# EAGLE design pcb-bldc-servo-3 (EAGLE 9.6.2)
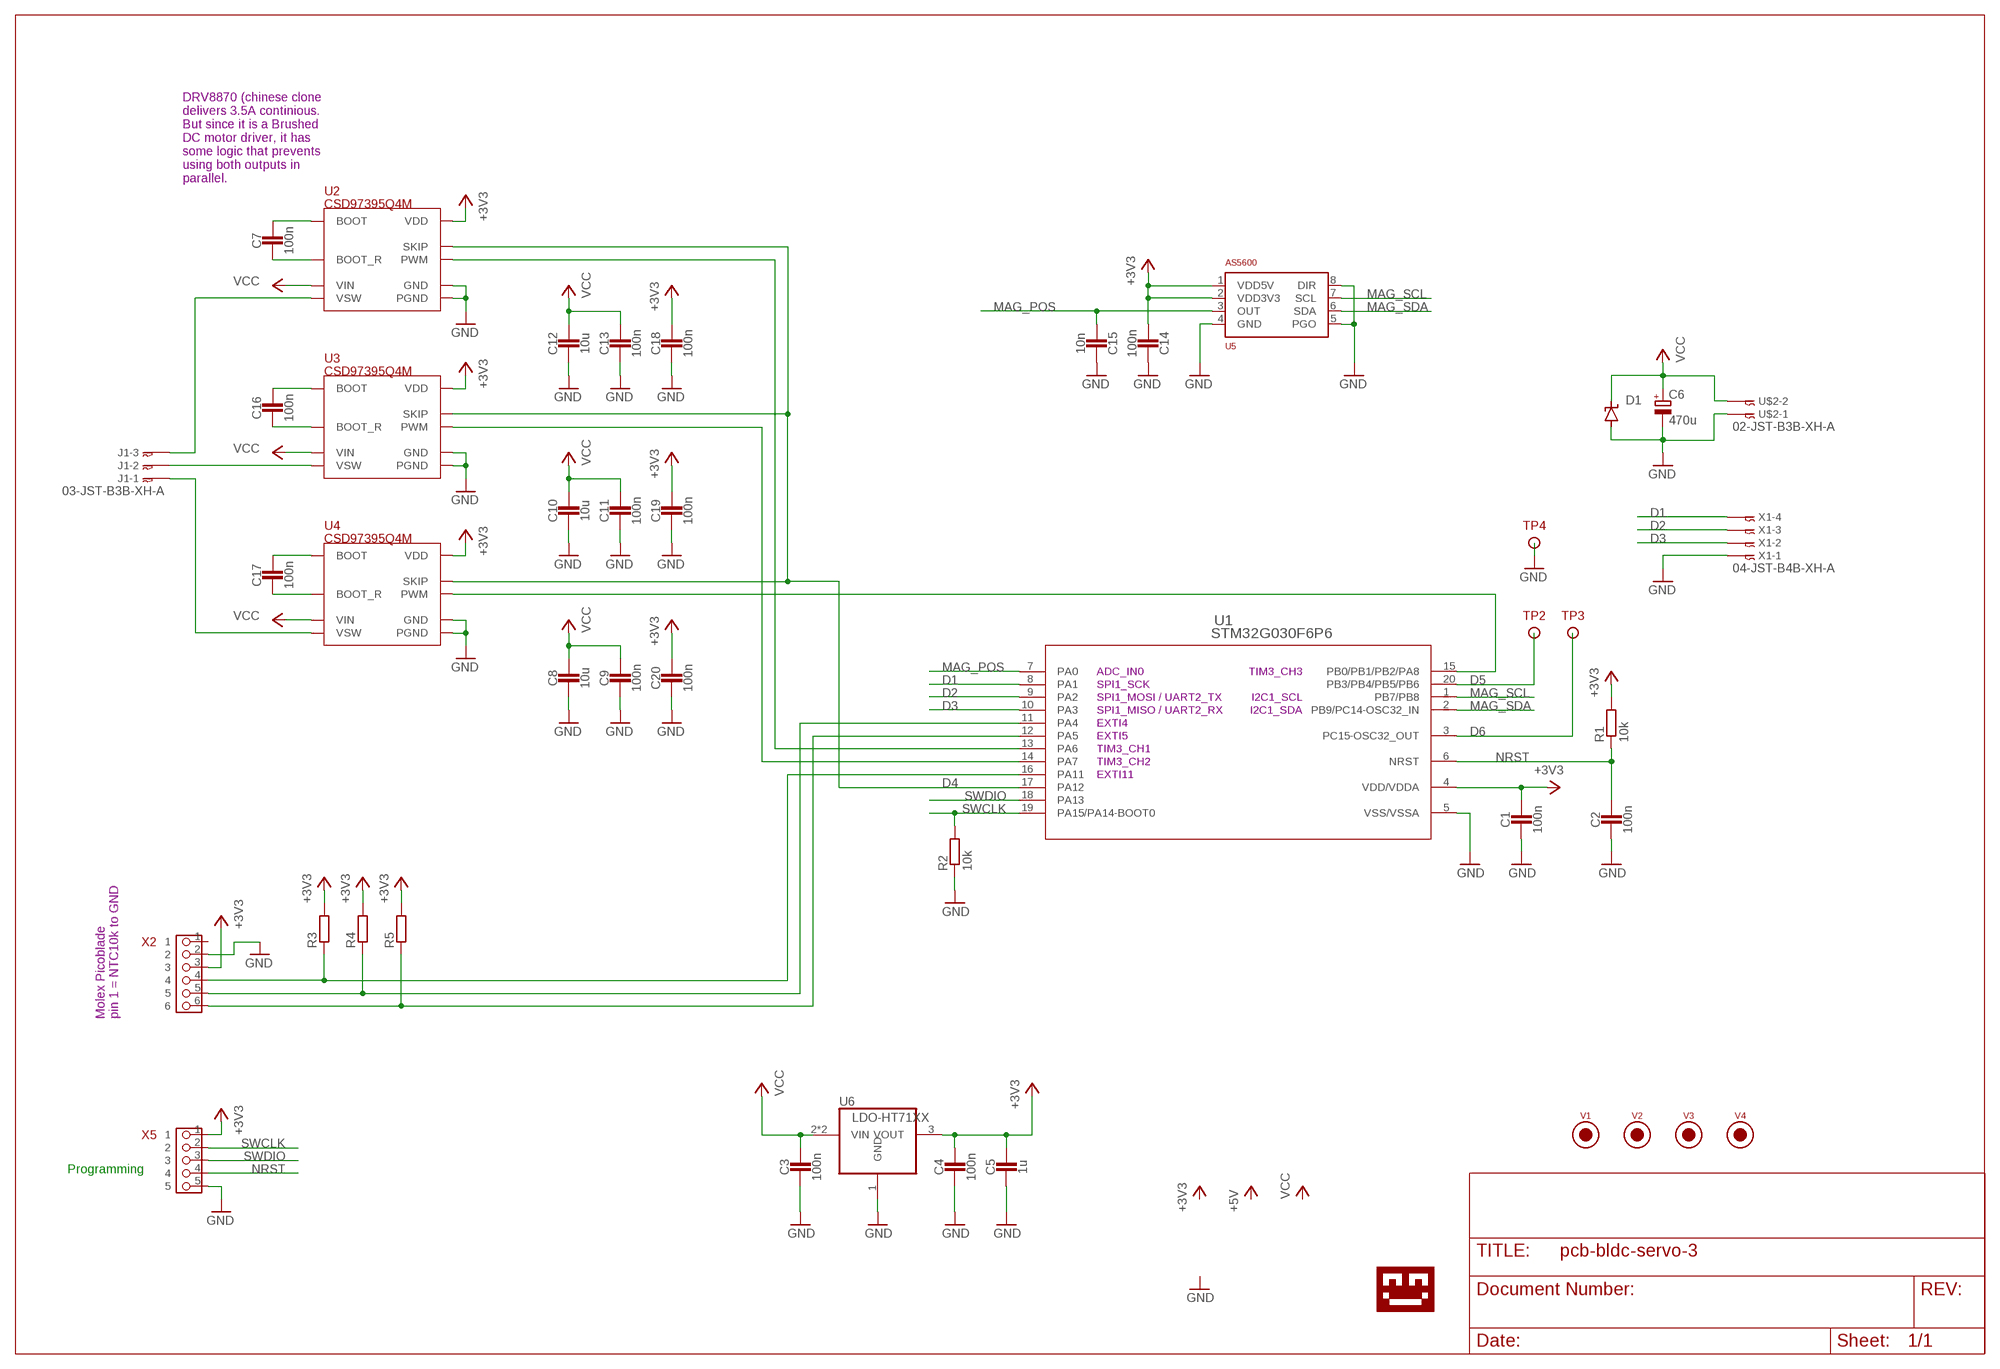
[diagram p0: schematic, sheet 1]

## Parts
C1  100n  CAPACITOR0603_CAP  [0603_CAP]
C2  100n  CAPACITOR0603_CAP  [0603_CAP]
C3  100n  CAPACITOR0603_CAP  [0603_CAP]
C4  100n  CAPACITOR0603_CAP  [0603_CAP]
C5  1u  CAPACITOR0603_CAP  [0603_CAP]
C6  470u  CPOL-EU153CLV-1010  [153CLV-1010]
C7  100n  CAPACITOR0603_CAP  [0603_CAP]
C8  10u  CAPACITOR1206_CAP  [1206_CAP]
C9  100n  CAPACITOR0603_CAP  [0603_CAP]
C10  10u  CAPACITOR1206_CAP  [1206_CAP]
C11  100n  CAPACITOR0603_CAP  [0603_CAP]
C12  10u  CAPACITOR1206_CAP  [1206_CAP]
C13  100n  CAPACITOR0603_CAP  [0603_CAP]
C14  100n  CAPACITOR0603_CAP  [0603_CAP]
C15  10n  CAPACITOR0603_CAP  [0603_CAP]
C16  100n  CAPACITOR0603_CAP  [0603_CAP]
C17  100n  CAPACITOR0603_CAP  [0603_CAP]
C18  100n  CAPACITOR0603_CAP  [0603_CAP]
C19  100n  CAPACITOR0603_CAP  [0603_CAP]
C20  100n  CAPACITOR0603_CAP  [0603_CAP]
D1  SUPPRESSOR-SMBJ  [SMBJ]
J1  03-JST-B3B-XH-A  [B3B-XH]
R1  10k  RESISTOR0603_RES  [0603-RES]
R2  10k  RESISTOR0603_RES  [0603-RES]
R3  RESISTOR0603_RES  [0603-RES]
R4  RESISTOR0603_RES  [0603-RES]
R5  RESISTOR0603_RES  [0603-RES]
TP2  TESTPIN1MM  [PIN-SMD-1X1-TEST_1M0]
TP3  TESTPIN1MM  [PIN-SMD-1X1-TEST_1M0]
TP4  TESTPIN1MM  [PIN-SMD-1X1-TEST_1M0]
U1  STM32G030F6P6  [TSSOP20]
U2  CSD97395Q4M  [CSD97395Q4M]
U3  CSD97395Q4M  [CSD97395Q4M]
U4  CSD97395Q4M  [CSD97395Q4M]
U5  AS5600  [SOIC-8]
U6  LDO-HT71XX  [SOT-89]
U$1  LOGO-TOBENG-1MM-FINISH  [TOBENG-1MM-FINISH]
U$2  02-JST-B3B-XH-A  [B2B-XH]
V1  FIDUCIAL2MM  [FIDUCIAL_2MM]
V2  FIDUCIAL2MM  [FIDUCIAL_2MM]
V3  FIDUCIAL2MM  [FIDUCIAL_2MM]
V4  FIDUCIAL2MM  [FIDUCIAL_2MM]
X1  04-JST-B4B-XH-A  [B4B-XH]
X2  PIN_6X1  [PIN_6X1_MOLEX_PICOBLADE]
X5  PIN_5X1HD  [PIN_5X1_HD]

## Nets
+3V3: C1.1 C4.1 C5.1 C14.1 C18.1 C19.1 C20.1 R1.2 R3.2 R4.2 R5.2 U1.4(VDD/VDDA) U2.VDD U2.VDD1(VDD) U3.VDD U3.VDD1(VDD) U4.VDD U4.VDD1(VDD) U5.1(VDD5V) U5.2(VDD3V3) U6.3(VOUT) X2.3 X5.1
D1: U1.8(PA1) X1.P$4
D2: U1.9(PA2) X1.P$3
D3: U1.10(PA3) X1.P$2
D4: U1.17(PA12) U2.SKIP U2.SKIP1(SKIP) U3.SKIP U3.SKIP1(SKIP) U4.SKIP U4.SKIP1(SKIP)
D5: TP2.1 U1.20(PB3/PB4/PB5/PB6)
D6: TP3.1 U1.3(PC15-OSC32_OUT)
GND: C1.2 C2.2 C3.2 C4.2 C5.2 C6.- C8.2 C9.2 C10.2 C11.2 C12.2 C13.2 C14.2 C15.2 C18.2 C19.2 C20.2 D1.A R2.1 TP4.1 U1.5(VSS/VSSA) U2.GND U2.GND1(GND) U2.PGND U3.GND U3.GND1(GND) U3.PGND U4.GND U4.GND1(GND) U4.PGND U5.4(GND) U5.5(PGO) U5.8(DIR) U6.1(GND) U$2.P$1 X1.P$1 X2.2 X5.5
MAG_POS: C15.1 U1.7(PA0) U5.3(OUT)
MAG_SCL: U1.1(PB7/PB8) U5.7(SCL)
MAG_SDA: U1.2(PB9/PC14-OSC32_IN) U5.6(SDA)
N$1: C7.1 U2.BOOT U2.BOOT1(BOOT)
N$2: C7.2 U2.BOOT_R U2.BOOT_R1(BOOT_R)
N$3: J1.P$2 U3.VSW U3.VSW1(VSW) U3.VSW2(VSW) U3.VSW3(VSW) U3.VSW4(VSW) U3.VSW5(VSW) U3.VSW6(VSW)
N$4: J1.P$3 U2.VSW U2.VSW1(VSW) U2.VSW2(VSW) U2.VSW3(VSW) U2.VSW4(VSW) U2.VSW5(VSW) U2.VSW6(VSW)
N$5: U1.13(PA6) U2.PWM U2.PWM1(PWM)
N$6: U1.14(PA7) U3.PWM U3.PWM1(PWM)
N$7: J1.P$1 U4.VSW U4.VSW1(VSW) U4.VSW2(VSW) U4.VSW3(VSW) U4.VSW4(VSW) U4.VSW5(VSW) U4.VSW6(VSW)
N$8: C16.1 U3.BOOT U3.BOOT1(BOOT)
N$9: U1.15(PB0/PB1/PB2/PA8) U4.PWM U4.PWM1(PWM)
N$10: C16.2 U3.BOOT_R U3.BOOT_R1(BOOT_R)
N$11: C17.1 U4.BOOT U4.BOOT1(BOOT)
N$12: C17.2 U4.BOOT_R U4.BOOT_R1(BOOT_R)
N$24: R5.1 U1.12(PA5) X2.6
N$25: R4.1 U1.11(PA4) X2.5
N$28: R3.1 U1.16(PA11) X2.4
NRST: C2.1 R1.1 U1.6(NRST) X5.4
SWCLK: R2.2 U1.19(PA15/PA14-BOOT0) X5.2
SWDIO: U1.18(PA13) X5.3
VCC: C3.1 C6.+ C8.1 C9.1 C10.1 C11.1 C12.1 C13.1 D1.C U2.VIN U2.VIN1(VIN) U2.VIN2(VIN) U2.VIN3(VIN) U2.VIN4(VIN) U2.VIN5(VIN) U2.VIN6(VIN) U3.VIN U3.VIN1(VIN) U3.VIN2(VIN) U3.VIN3(VIN) U3.VIN4(VIN) U3.VIN5(VIN) U3.VIN6(VIN) U4.VIN U4.VIN1(VIN) U4.VIN2(VIN) U4.VIN3(VIN) U4.VIN4(VIN) U4.VIN5(VIN) U4.VIN6(VIN) U6.2(VIN) U6.2@1(VIN) U$2.P$2
Unconnected: X2.1

## Notes on the sheet
- DRV8870 (chinese clone
  delivers 3.5A continious.
  But since it is a Brushed
  DC motor driver, it has
  some logic that prevents
  using both outputs in 
  parallel.
- ADC_IN0 | TIM3_CH3
- SPI1_SCK
- SPI1_MOSI / UART2_TX | I2C1_SCL
- SPI1_MISO / UART2_RX | I2C1_SDA
- EXTI4
- EXTI5
- TIM3_CH1
- TIM3_CH2
- EXTI11
- Molex Picoblade
  pin 1 = NTC10k to GND
- Programming

## Library data of the parts
C1-C5 C7-C20 = passives:CAPACITOR: SMD Capacitor
C6 = resistor:CPOL-EU: POLARIZED CAPACITOR, European symbol
D1 = diode:SUPPRESSOR-: Suppressor diode
J1 = bt_con-jst-xh:03-JST: JST CONNECTOR
R1-R5 = passives:RESISTOR: Resistor Basic schematic elements and footprints for 0201, 0402, 0603, 1206, and PTH resistors.
TP2-TP4 = ftobler_backup:TESTPIN
U1 = stm32:STM32G030F6P6; COPYRIGHT: Copyright (C) 2024 Ultra Librarian. All rights reserved.; MANUFACTURER_PART_NUMBER: STM32G030F6P6; MFR_NAME: STMicroelectronics
U2-U4 = ftobler:CSD97395Q4M
U5 = ftobler:AS5600
U6 = ftobler:LDO
U$1 = ftobler:LOGO
U$2 = bt_con-jst-xh:02-JST: JST CONNECTOR
V1-V4 = ftobler - Copy:FIDUCIAL
X1 = bt_con-jst-xh:04-JST: JST CONNECTOR
X2 = ftobler-conn:PIN_6X1
X5 = ftobler-conn:PIN_5X1

## Board
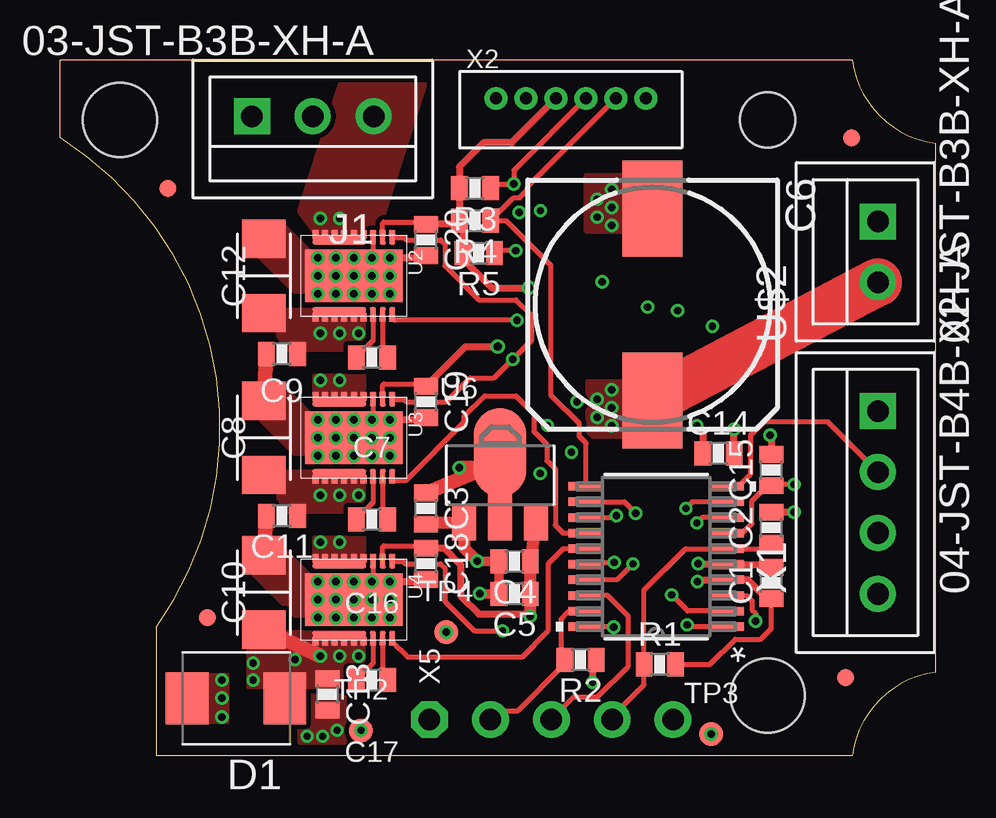
[diagram p1: board, top side]
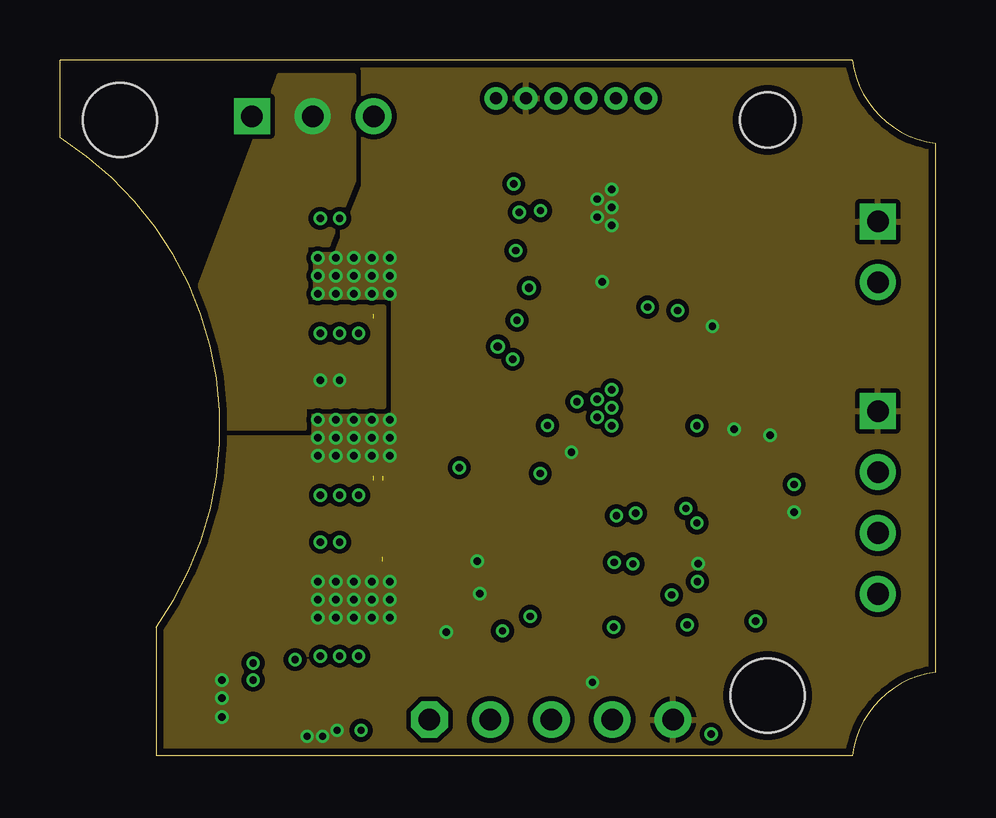
[diagram p2: board, inner layer Route2]
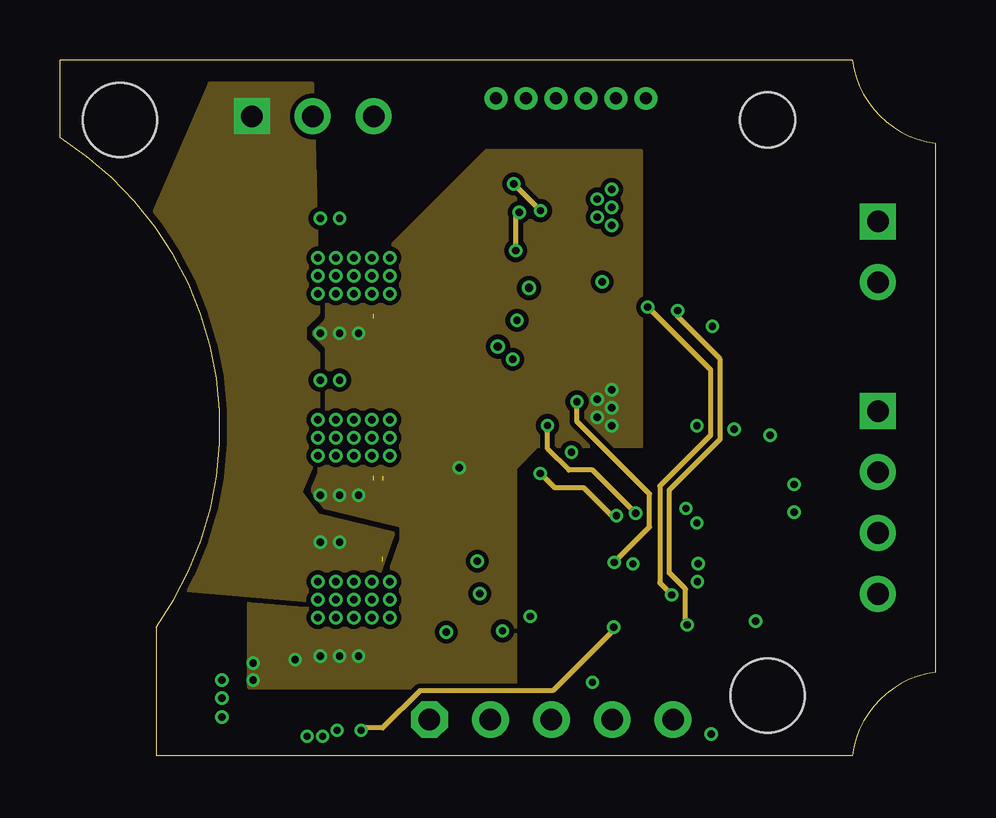
[diagram p3: board, inner layer Route15]
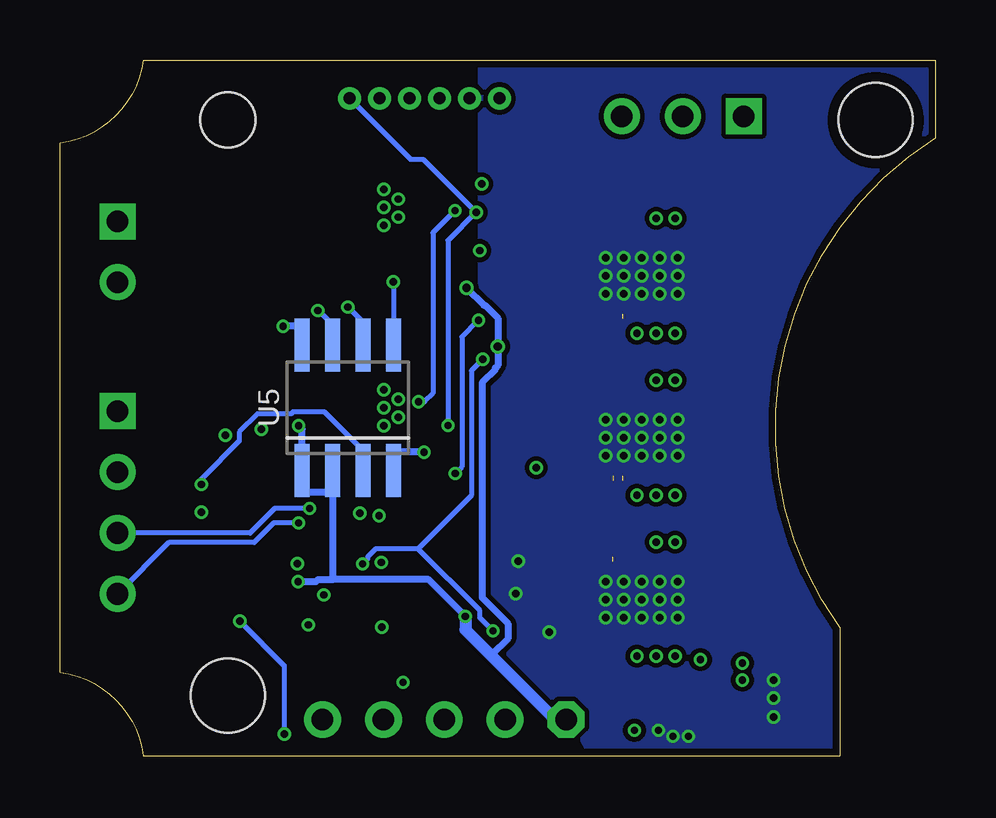
[diagram p4: board, bottom side, seen from below]

Size 36.5 x 29 mm. Coordinates in mm from the lower left corner, seen from the top.
Outline: 36.5,3.47 arc76 33.03,0 4,0 4,5.34 arc93 0,25.76 0,29 33.03,29 arc76 36.5,25.53 36.5,3.47
Copper layers (1+2*15+16): Top 0.035mm / dielectric 0.2mm / Route2 0.035mm / dielectric 0.4mm / Route15 0.035mm / dielectric 0.2mm / Bottom 0.035mm
Design rules "default *": minimum track width 0.15mm, minimum drill 0.2mm, track to track 0.2mm, track to pad 0.2mm, pad to pad 0.15mm, via to via 0.2mm, smd to smd 0.2mm, copper to edge 0.3mm, drill to drill 10mil, minimum pad ring 0.125mm, minimum via ring 0.125mm, stop-mask expansion 0.05mm, vias tented up to drill 0.35mm, thermal gap 0.2mm
Holes 3.1 mm at 2.5,26.5 29.5,2.5
Holes 2.3 mm at 29.5,26.5
tRestrict: area 0.5,24.5 to 4.5,28.5; area 27.5,24.5 to 31.5,28.5; area 27.5,0.5 to 31.5,4.5
bRestrict: area 0.5,24.5 to 4.5,28.5; area 27.5,24.5 to 31.5,28.5; area 27.5,0.5 to 31.5,4.5; 1 lines

### Footprints (pad centres in the part's own frame; a part is rotated, then mirrored left to right if it is on the bottom)
0603_CAP = smd 0.7 x 1: 1 -0.65,0; 2 0.65,0
153CLV-1010 = smd 4 x 2.5: + 4,0; - -4,0
1206_CAP = smd 1.6 x 1.8: 1 -1.55,0; 2 1.55,0
SMBJ = smd 1.78 x 2.16: A 2.04,0; C -2.03,0
B3B-XH = drill 0.9 pad 1.5 square: P$1 2.54,0 | drill 0.9 pad 1.5: P$2 0,0; P$3 -2.54,0
0603-RES = smd 0.7 x 1: 1 -0.65,0; 2 0.65,0
PIN-SMD-1X1-TEST_1M0 = smd 1 x 1: 1 0,0
TSSOP20 = smd 1.462 x 0.355: 1 -2.921,2.925; 2 -2.921,2.275; 3 -2.921,1.625; 4 -2.921,0.975; 5 -2.921,0.325; 6 -2.921,-0.325; 7 -2.921,-0.975; 8 -2.921,-1.625; 9 -2.921,-2.275; 10 -2.921,-2.925; 11 2.921,-2.925; 12 2.921,-2.275; 13 2.921,-1.625; 14 2.921,-0.975; 15 2.921,-0.325; 16 2.921,0.325; 17 2.921,0.975; 18 2.921,1.625; 19 2.921,2.275; 20 2.921,2.925
CSD97395Q4M = smd 0.25 x 0.6: BOOT -1.2,1.6; BOOT_R -0.8,1.6; GND -0.8,-1.6; PWM -1.6,1.6; SKIP -1.6,-1.6; VDD -1.2,-1.6 | smd 0.25 x 0.25: BOOT1 -1.2,1.775; BOOT_R1 -0.8,1.775; GND1 -0.8,-1.775; PWM1 -1.6,1.775; SKIP1 -1.6,-1.775; VDD1 -1.2,-1.775 | smd 4.05 x 2.2: PGND 0,0 | smd 2.25 x 0.375: VIN 0.6,1.488; VSW 0.6,-1.488 | smd 0.25 x 0.35: VIN1 -0.4,1.725; VIN2 0,1.725; VIN3 0.4,1.725; VIN4 0.8,1.725; VIN5 1.2,1.725; VIN6 1.6,1.725; VSW1 -0.4,-1.725; VSW2 0,-1.725; VSW3 0.4,-1.725; VSW4 0.8,-1.725; VSW5 1.2,-1.725; VSW6 1.6,-1.725
SOIC-8 = smd 0.61 x 2.21: 1 -1.905,-2.616; 2 -0.635,-2.616; 3 0.635,-2.616; 4 1.905,-2.616; 5 1.905,2.616; 6 0.635,2.616; 7 -0.635,2.616; 8 -1.905,2.616
SOT-89 = smd 1 x 1.5: 1 -1.499,-1.981; 3 1.499,-1.981 | smd 1 x 2: 2 0,-1.727 | smd 2.2 x 3.7: 2@1 0,0.94
B2B-XH = drill 0.9 pad 1.5 square: P$1 1.27,0 | drill 0.9 pad 1.5: P$2 -1.27,0
FIDUCIAL_2MM = smd 0.7 x 0.7: V 0,0
B4B-XH = drill 0.9 pad 1.5 square: P$1 3.81,0 | drill 0.9 pad 1.5: P$2 1.27,0; P$3 -1.27,0; P$4 -3.81,0
PIN_6X1_MOLEX_PICOBLADE = drill 0.5 pad 0.95: 1 -3.125,0; 2 -1.875,0; 3 -0.625,0; 4 0.625,0; 5 1.875,0; 6 3.125,0
PIN_5X1_HD = drill 0.9 pad 1.54 octagon: 1 0,0 | drill 0.9 pad 1.54: 2 0,-2.54; 3 0,-5.08; 4 0,-7.62; 5 0,-10.16

### Placement (x,y rotation side)
C1  29.65,7.2 90 top
C2  29.65,9.5 90 top
C3  15.25,10.3 270 top
C4  18.95,8.1 180 top
C5  18.95,6.75 180 top
C6  24.7,18.8 270 top
C7  13,16.6 180 top
C8  8.5,13.25 90 top
C9  9.25,16.75 180 top
C10  8.5,6.8 90 top
C11  9.25,10 180 top
C12  8.5,20 90 top
C13  11.15,2.55 270 top
C14  27.45,12.6 0 top
C15  29.65,11.9 90 top
C16  13,9.85 180 top
C17  13,3.15 180 top
C18  15.25,8 270 top
C19  15.25,14.75 270 top
C20  15.25,21.5 270 top
D1  7.35,2.39 180 top
J1  10.54,26.65 180 top
R1  25,3.8 0 top
R2  21.7,4 180 top
R3  17.3,23.65 180 top
R4  17.3,22.3 180 top
R5  17.45,20.95 180 top
TP2  12.55,1.05 0 top
TP3  27.15,0.9 0 top
TP4  16.1,5.15 0 top
U1  24.85,8.3 180 top
U2  12.25,20 180 top
U3  12.25,13.25 180 top
U4  12.25,6.5 180 top
U5  24.5,14.5 0 bottom
U6  18.35,11.7 0 top
U$1  11.45,14.95 90 bottom
U$2  34.1,21 90 top
V1  4.5,23.65 0 top
V2  33,25.75 0 top
V3  32.75,3.25 0 top
V4  6.15,5.75 0 top
X1  34.1,10.55 90 top
X2  21.3,27.4 0 top
X5  15.4,1.5 90 top

### Tracks (layer width: path | path; a pad name or v marks a point on that pad's centre or on a via)
+3V3  (via drill 0.3 pad 0.45, 0.35)  (1 unrouted)
  Top 0.2: R1.2 27.1,3.8 28.15,4.85 29.2,4.85 29.65,5.3 C1.1 | C18.1 15.15,8.75 13.5,8.75 13.45,8.7 U4.VDD | C19.1 15.15,15.5 13.5,15.5 13.45,15.45 U3.VDD U3.VDD1 | 15.4,22.3 C20.1 15.15,22.25 13.5,22.25 13.45,22.2 U2.VDD1 U2.VDD
  Top 0.3: X2.3 18.82,25.55 17.65,25.55 16.65,24.55 R3.2 R4.2 | R4.2 16.8,22.15 R5.2 16.8,20.7 18,19.5 v19.55,19.5 | C1.1 29.45,6.55 28.68,7.33 U1.4 26.65,7.33 v26.58,7.25 | v26.55,13.75 26.8,13.5 C14.1 | R4.2 16.5,22.15 C20.1 | C18.1 16,8.65 16.7,7.95 16.7,6.67 17.47,5.9 19.5,5.9 v19.6,5.8 | C19.1 16.9,17.05 v18.25,17.05
  Top 0.5: U6.3 C4.1 C5.1 v19.6,5.8
  Bottom 0.3: v26.55,13.75 26.41,13.61 U5.1 26.41,11.01 26.4,11 25.22,11 25.14,11.09 | 25.14,11.09 U5.2 25.14,7.34 | 25.14,11.09 25.05,11 | v26.58,7.25 25.83,7.25 25.76,7.33 25.15,7.33 25.14,7.34 | v19.6,5.8 21.14,7.34 25.14,7.34 | v19.55,19.5 18.82,18.77 18.79,18.77 18.25,18.23 v18.25,17.05 18.25,16.27 18.35,16.17 18.35,16.1 18.9,15.55 18.9,6.58 17.82,5.51 17.82,4.88 18.52,4.17
  Bottom 0.5: v19.6,5.8 19.6,5.25 18.52,4.17 15.85,1.5 X5.1
D1  (via drill 0.3 pad 0.45)
  Top 0.2: U1.8 26.77,9.93 v26.55,9.7
  Bottom 0.2: v26.55,9.7 27.58,9.7 28.4,8.88 31.96,8.88 X1.P$4
D2  (via drill 0.3 pad 0.45)
  Top 0.2: U1.9 26.36,10.57 v26.09,10.3
  Bottom 0.2: v26.09,10.3 27.55,10.3 28.57,9.28 X1.P$3
D3
  Top 0.2: U1.10 28.27,11.22 28.8,11.75 28.8,13.36 29.36,13.93 32,13.93 X1.P$2
D4  (via drill 0.3 pad 0.45)
  Top 0.2: v23.89,7.99 23.22,7.33 U1.17 | v18.45,5.2 17.28,5.2 16.05,6.43 16.05,7.82 15.87,8 14.4,8 14.3,8.1 U4.SKIP U4.SKIP1 | U3.SKIP1 U3.SKIP 14.35,14.85 14.45,14.75 16.1,14.75 17.1,15.75 18.1,15.75 v18.88,16.52 19.65,17.3 19.65,18.36 19.01,19 17.48,19 16.05,20.43 16.05,21.32 15.87,21.5 14.45,21.5 14.35,21.6 U2.SKIP U2.SKIP1
  Bottom 0.2: v18.45,5.2 19,5.75 19,6.05 21.58,8.62 | v23.89,7.99 23.68,8.2 23.68,8.29 23.34,8.62 21.58,8.62 | v18.88,16.52 19.35,16.05 19.35,10.85 21.58,8.62
D5  (via drill 0.3 pad 0.45)
  Top 0.2: U1.20 23.06,5.38 v23.09,5.35
  Route15 0.2: v23.09,5.35 23.09,5.24 20.55,2.7 15,2.7 13.46,1.16 12.55,1.16 TP2.1
  other vias: 12.55,1.05
D6  (via drill 0.3 pad 0.45)
  Top 0.2: U1.3 28.62,6.67 28.85,6.45 28.85,6.08 29,5.93 v29,5.6
  Bottom 0.2: v29,5.6 27.15,3.75 TP3.1
  other vias: 27.15,0.9
GND  (via drill 0.3 pad 0.45)
  Top 0.2: v13,7.25 13.05,7.3 U4.GND U4.GND1 | v13,14 13.05,14.05 U3.GND U3.GND1 | v13,20.75 13.05,20.8 U2.GND U2.GND1
  Top 0.3: R2.1 22.2,3.85 v22.2,3.05 | C14.2 v28.1,13.6 | v29.6,13.35 29.65,13.3 C15.2 | C2.2 v30.6,10.15 | C1.2 29.52,7.97 U1.5 26.62,7.97 v26.6,8 | C20.2 15.15,20.75 v13.75,20.75 | C19.2 15.15,14 v13.75,14 | C18.2 15.15,7.25 v13.75,7.25
  Top 0.4: v17.5,6.75 C5.2 C4.2 v17.4,8.1
  Top 0.5: C3.2 15.25,9.72 U6.1 16.85,8.65 v17.4,8.1
  Top 0.6: C9.2 C8.2 | C11.2 8.58,9.98 C10.2
  Route15 0.2: TP4.1 16.15,5.15
  Bottom 0.2: v22.6,19.75 U5.5
  Bottom 0.3: U5.5 | v27.2,17.9 26.7,17.9 26.41,17.61 U5.8 | v21.32,12.65 22.5,12.65 22.59,12.55 U5.4
  other vias: 11.5,20 11.5,20.75 12.25,20.75 12.25,20 12.25,19.25 13,19.25 13,20 13.75,20 13.75,19.25 23,23.6 23,22.85 23,22.1 22.4,22.45 22.4,23.2 16.1,5.15 11.5,19.25 10.75,19.25 10.75,20 10.75,20.75 11.5,13.25 11.5,14 12.25,14 12.25,13.25 12.25,12.5 13,12.5 13,13.25 13.75,13.25 13.75,12.5 11.5,12.5 10.75,12.5 10.75,13.25 10.75,14 11.5,6.5 11.5,7.25 12.25,7.25 12.25,6.5 12.25,5.75 13,5.75 13,6.5 13.75,6.5 13.75,5.75 11.5,5.75 10.75,5.75 10.75,6.5 10.75,7.25 11.55,1.05 10.3,0.8 10.95,0.8 6.75,3.15 6.75,1.6 6.75,2.4
  pour Route2 (rank 2): -2,31 39,31 39,-2 -2,-2 arc1
  pour Bottom: -1,-0.3 -1,29.95 19,29.95 19,-0.3
  pour Top (no thermals): 21.95,24.2 24.9,24.2 24.9,21.85 21.95,21.85
  pour Top (no thermals): 9.2,22.2 10.8,20.6 10.8,19.35 9.8,19.35 8.07,21.07
  pour Top (no thermals): 9.2,15.45 10.8,13.85 10.8,12.6 9.8,12.6 8.07,14.32
  pour Top (no thermals): 9.2,8.7 10.8,7.1 10.8,5.85 9.8,5.85 8.07,7.58
  pour Top (no thermals): 5.1,3.35 6.95,3.35 6.95,1.4 5.1,1.4
  pour Top (rank 2, no thermals): 10,2.5 11.85,2.5 11.85,0.55 10,0.55
MAG_POS  (via drill 0.3 pad 0.45)
  Top 0.2: U1.7 28.45,9.28 28.85,9.67 28.85,10.62 29.43,11.2 29.43,11.25 C15.1 29.7,11.3 v30.6,11.3
  Bottom 0.2: U5.3 23.86,12.71 25.48,14.32 26.79,14.32 26.86,14.25 28.26,14.25 29.02,13.49 29.02,13.11 30.6,11.54 v30.6,11.3
MAG_SCL  (via drill 0.3 pad 0.45)
  Top 0.2: U1.1 26.23,5.38 v26.15,5.45
  Route15 0.2: v26.15,5.45 26.07,5.53 26.07,6.94 25.4,7.61 25.4,11.07 27.52,13.2 27.52,16.52 25.75,18.3 v25.75,18.55
  Bottom 0.2: v25.75,18.55 25.72,18.55 25.14,17.97 U5.7
MAG_SDA  (via drill 0.3 pad 0.45)
  Top 0.2: U1.2 26.18,6.03 v25.5,6.7
  Route15 0.2: v25.5,6.7 25,7.2 25,11.24 27.12,13.36 27.12,16.07 v24.5,18.7
  Bottom 0.2: v24.5,18.7 23.86,18.07 U5.6
N$1
  Top 0.2: C7.1 13.45,16.8 U2.BOOT1 13.45,18.25 U2.BOOT
N$2  (1 unrouted)
  Top 0.2: C7.2 13.05,17.3 U2.BOOT_R
N$3  (via drill 0.3 pad 0.45)
  other vias: 11.65,15.65 10.85,15.65
  pour Top (no thermals): 12.7,14.65 10.6,14.65 10.6,15.85 12.7,15.85
  pour Route2 (no thermals): 12.25,28.35 9.13,28.35 5.5,18.75 6.4,13.65 10.2,13.65 10.2,14.55 13.5,14.55 13.5,18.7 10.25,18.7 10.25,21.3 11.18,21.3 12.25,24
N$4  (via drill 0.3 pad 0.45)
  other vias: 11.65,22.4 10.85,22.4
  pour Top (no thermals): 12.7,21.4 10.6,21.4 10.6,22.6 12.7,22.6
  pour Top (no thermals): 13.21,21.65 10.69,21.65 9.94,22.68 11.65,28 15.25,28
N$5  (via drill 0.3 pad 0.45)
  Top 0.2: U1.13 23.12,9.93 v23.2,10 | v19.05,18.15 13.95,18.15 13.88,18.23 U2.PWM1 U2.PWM
  Route15 0.2: v23.2,10 23,10 21.84,11.16 20.62,11.16 v20.02,11.76
  Bottom 0.2: v20.02,11.76 19.75,12.03 19.75,17.45 v19.05,18.15
N$6
  Top 0.2: U1.14 20.98,9.28 20.65,9.6 20.65,11.95 20.3,12.3 20.3,12.97 19.75,13.52 19.75,14.25 19,15 17.7,15 16.85,14.15 16.85,13.9 14.43,11.47 U3.PWM1 U3.PWM
N$7  (via drill 0.3 pad 0.45)
  other vias: 11.65,8.9 10.85,8.9
  pour Top (no thermals): 12.7,7.9 10.6,7.9 10.6,9.1 12.7,9.1
  pour Route15 (no thermals): 4.5,7 12.83,6.28 13.87,9.25 10.75,10 10,11 10.75,12.75 10.75,16.75 10.2,17.3 10.2,17.9 10.75,18.45 10.5,28 6.25,28 3,20.5
N$8  (1 unrouted)
  Top 0.2: C16.1 13.45,10.05 13.45,11.45 U3.BOOT
N$9
  Top 0.2: U1.15 20.98,8.62 20.35,8 20.35,5.2 19.25,4.1 14.5,4.1 13.85,4.75 U4.PWM U4.PWM1
N$10  (1 unrouted)
  Top 0.2: C16.2 13.05,10.55 13.05,11.45 U3.BOOT_R
N$11
  Top 0.2: C17.1 13.45,3.35 U4.BOOT U4.BOOT1
N$12
  Top 0.2: C17.2 13.05,3.85 U4.BOOT_R U4.BOOT_R1
N$24  (via drill 0.3 pad 0.45)
  Top 0.2: R5.1 18.2,21.05 v19,21.05 | U1.12 23.52,10.57 v24,10.1
  Route15 0.2: v24,10.1 22.2,11.9 21.22,11.9 20.32,12.79 v20.32,13.76 | v19,21.05 19,22.5 v19.15,22.65
  Bottom 0.2: X2.6 21.89,24.86 21.36,24.86 v19.15,22.65 20.32,21.48 v20.32,13.76
N$25
  Top 0.2: U1.11 21.93,13.02 21.65,13.3 21.65,13.84 20.45,15.04 20.45,20.45 18.6,22.3 R4.1 18.91,23.26 19.16,23.26 19.49,23.59 19.49,23.72 X2.5
N$28  (via drill 0.3 pad 0.45)
  Top 0.2: X2.4 18.92,24.39 v18.92,23.83 18.13,23.83 R3.1 | U1.16 22,8.05 v23.1,8.05
  Route15 0.2: v18.92,23.83 v20.03,22.72 | v21.55,14.75 21.55,13.94 24.57,10.91 24.57,9.53 v23.1,8.05
  Bottom 0.2: v20.03,22.72 20.95,21.8 20.95,15.1 21.3,14.75 v21.55,14.75
NRST
  Top 0.2: X5.4 23.02,1.62 24.35,2.95 R1.1 24.35,6.9 26.07,8.62 U1.6 29.43,8.62 C2.1
SWCLK
  Top 0.2: 21.91,6 U1.19 21.23,6.03 20.9,5.7 20.9,4.15 R2.2 21,3.78 19.07,1.85 18.29,1.85 X5.2
SWDIO
  Top 0.2: U1.18 22.82,6.67 23.69,5.81 23.69,3.73 22.41,2.45 21.43,2.45 X5.3
VCC  (via drill 0.3 pad 0.45)
  Top 0.5: U6.2 U6.2@1 | U6.2@1 18.35,12.7 18.2,12.85 18.2,12.79 U6.2@1
  Top 0.6: v10.85,4.15 v10.84,4.16 C10.1 | U6.2@1 18.14,12.49 | 18.14,12.49 17.46,12 v16.65,12 | C3.1 17.3,11.8 18.14,12.49
  Top 2: C6.+ U$2.P$2
  other vias: 23,15.25 23,14.5 23,13.75 22.4,14.1 22.4,14.85 11.65,4.15 12.45,4.15 10.85,17.6 11.65,17.6 12.45,17.6 10.85,10.85 11.65,10.85 12.45,10.85 9.8,4 8.05,3.85 8.05,3.15
  pour Top (no thermals): 22,15.6 25.4,15.6 25.4,13.3 22,13.3
  pour Route15 (rank 2): 7.9,2.85 7.9,19.6 12.2,19.6 17.8,25.2 24.2,25.2 24.2,12.9 19.85,12.9 18.95,12 18.95,2.85
  pour Top (no thermals): 7.85,5.15 12.7,5.15 12.7,2.85 7.85,2.85
  pour Top (no thermals): 9.1,18.6 12.7,18.6 12.7,16.9 9.1,16.9
  pour Top (no thermals): 9.1,11.85 12.7,11.85 12.7,10.15 9.1,10.15

### Text on the board
tStop: V2 | V1 | V4 | GND | V4 | V3 | D5 | D6
tFinish: JLCJLCJLCJLC | 3 | C | D | R | G
bFinish: W | V | U | G | + | C | B | A | GND | VCC | GND | D3 | D2 | pcb-bldc-servo v3 / by ftobler 2024 | D1 | 3 | C | D | R | G